# EasyEDA schematic MainBoard_2020-05-08_18-35-21.json
TITLE: Main Board; REV: 1.0; Date: 2019-05-19; Sheet: 1/1; Drawn By: jimbotops; Company: TophamTech
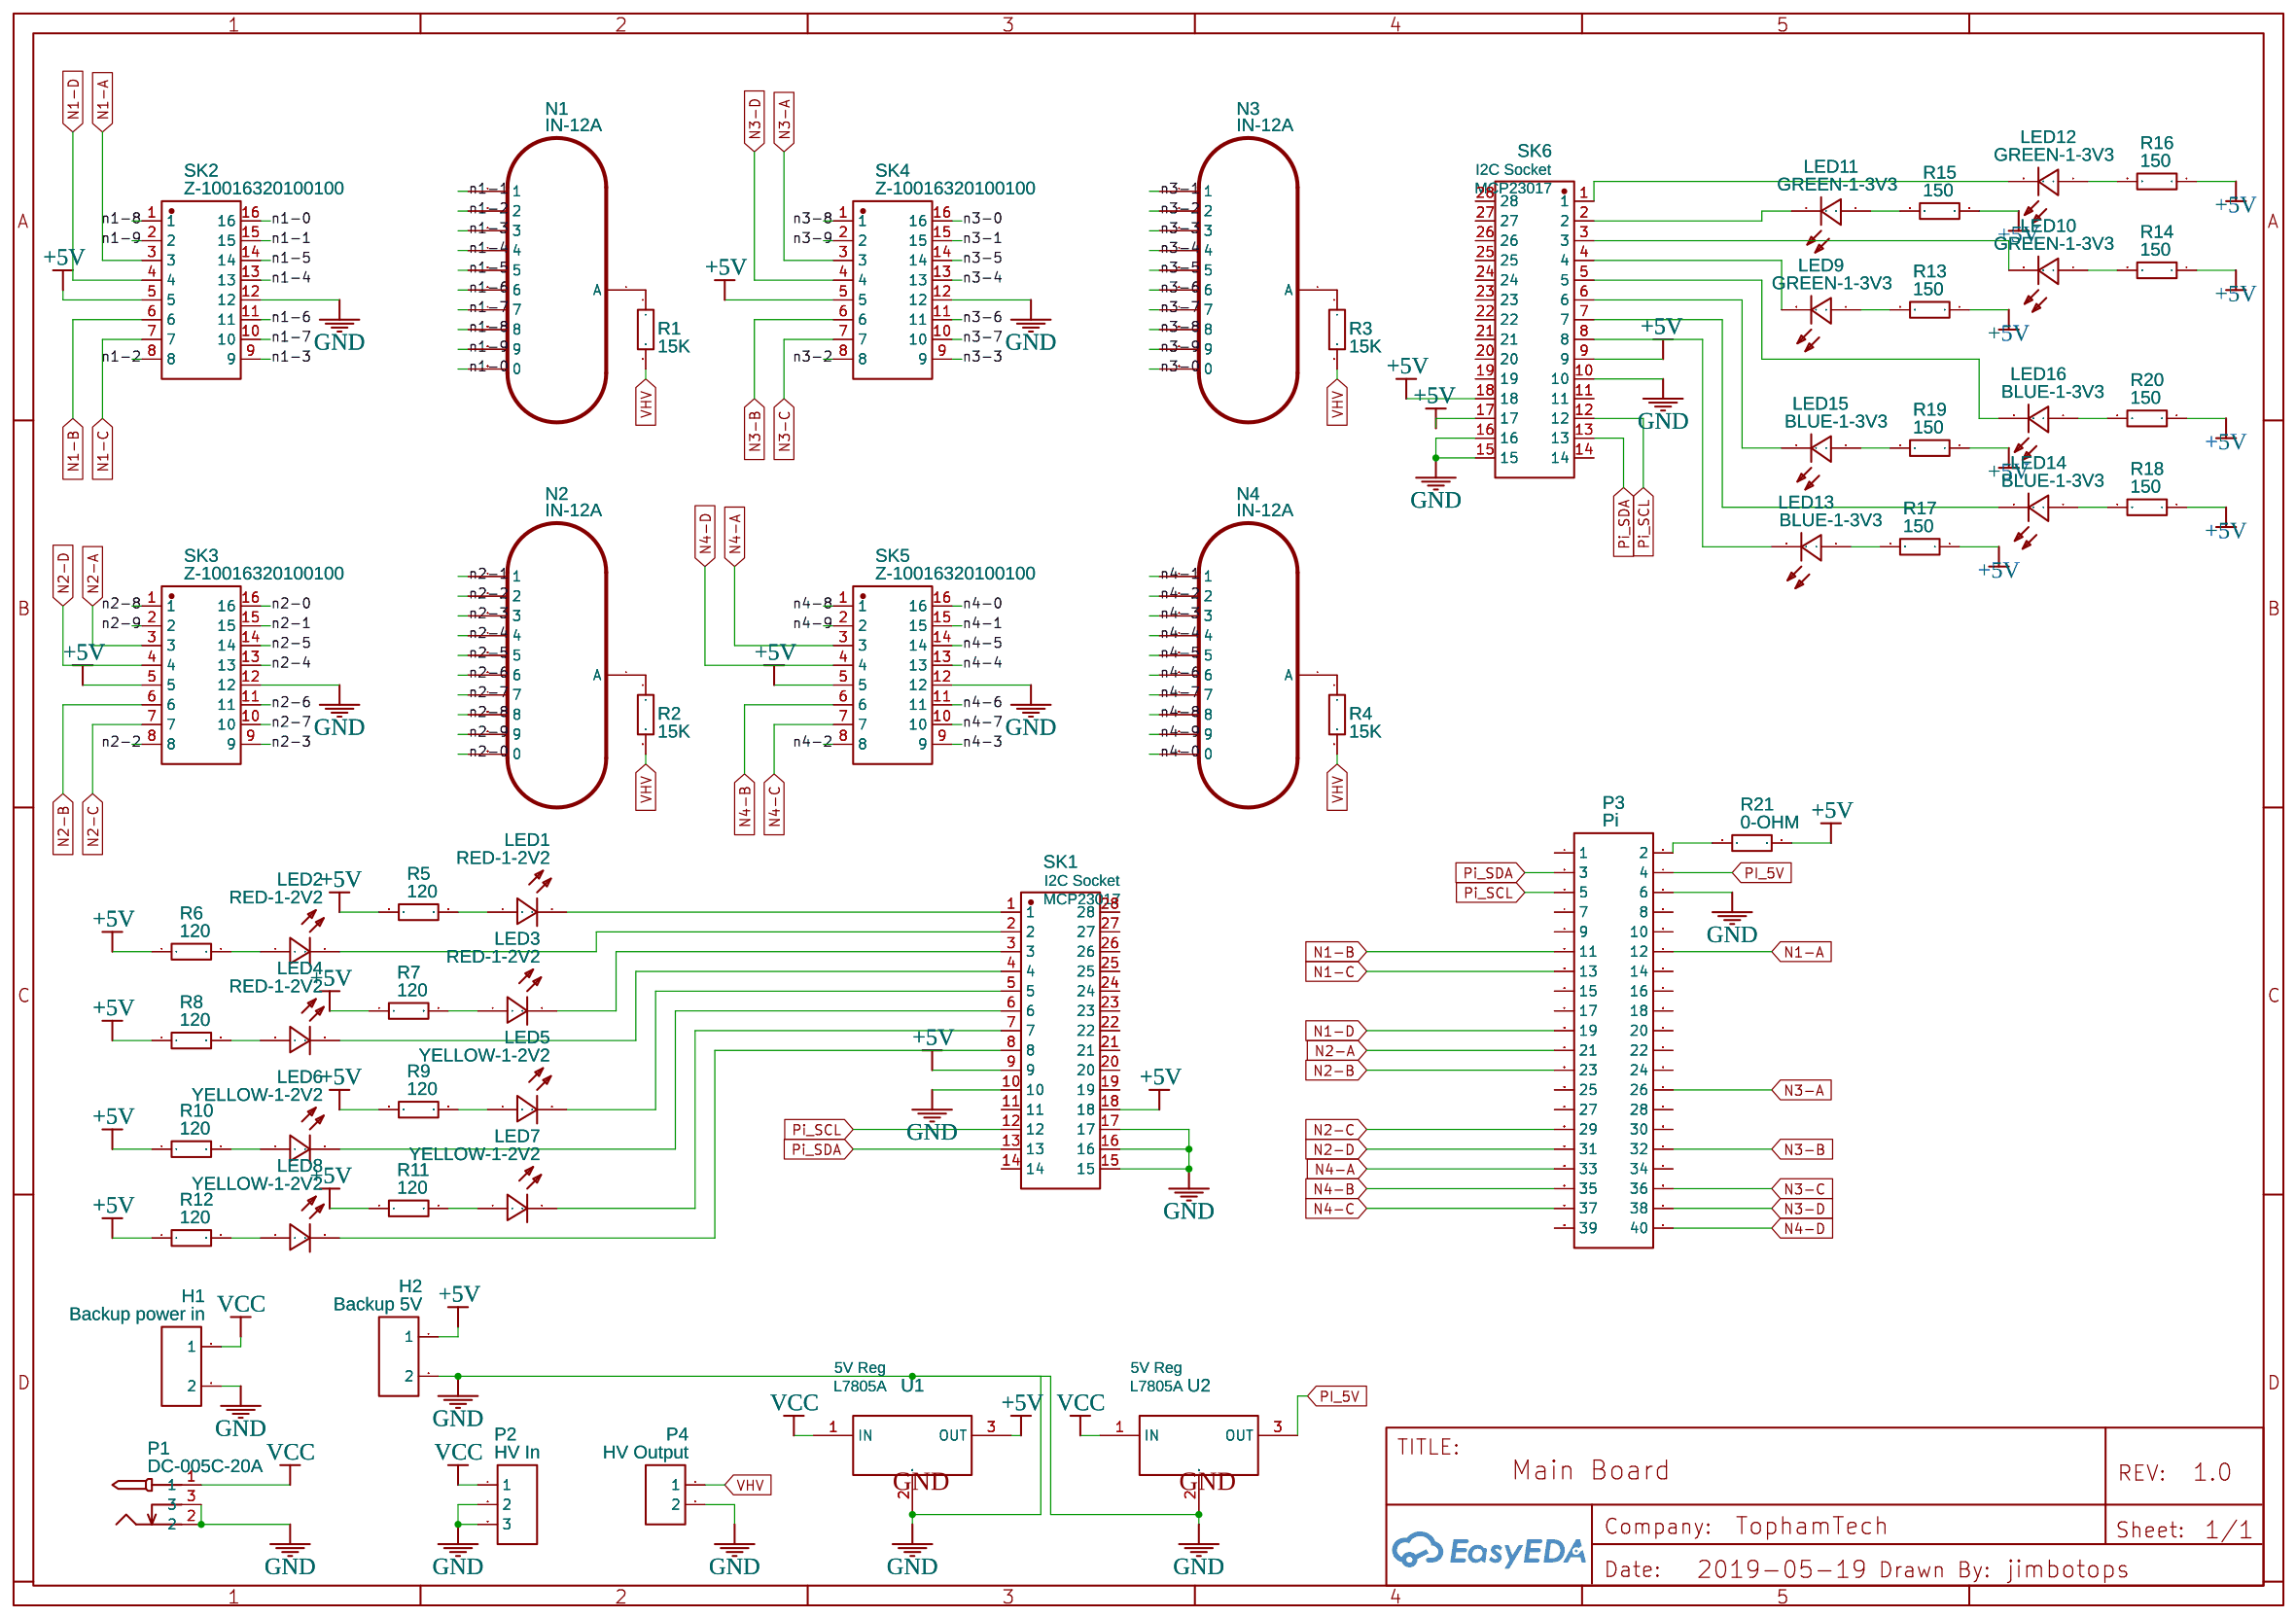
[diagram p0: schematic sheet]

## Parts
H1  Backup power in  [HDR-2X1/2.54]
H2  Backup 5V  [HDR-2X1/2.54]
LED1  RED-1-2V2  [LED-1206]
LED2  RED-1-2V2  [LED-1206]
LED3  RED-1-2V2  [LED-1206]
LED4  RED-1-2V2  [LED-1206]
LED5  YELLOW-1-2V2  [LED-1206]
LED6  YELLOW-1-2V2  [LED-1206]
LED7  YELLOW-1-2V2  [LED-1206]
LED8  YELLOW-1-2V2  [LED-1206]
LED9  GREEN-1-3V3  [LED-1206]
LED10  GREEN-1-3V3  [LED-1206]
LED11  GREEN-1-3V3  [LED-1206]
LED12  GREEN-1-3V3  [LED-1206]
LED13  BLUE-1-3V3  [LED-1206]
LED14  BLUE-1-3V3  [LED-1206]
LED15  BLUE-1-3V3  [LED-1206]
LED16  BLUE-1-3V3  [LED-1206]
N1  IN-12A  [IN-12]
N2  IN-12A  [IN-12]
N3  IN-12A  [IN-12]
N4  IN-12A  [IN-12]
P1  DC-005C-20A  [DC-005C-A]
P2  HV In  [HDR-3X1/2.54]
P3  Pi  [HDR-TH_40PIN-V-ROW2-COL20-FEMALE-PITCH2.54]
P4  HV Output  [HDR-1X2/2.54]
R1  15K  [2010]
R2  15K  [2010]
R3  15K  [2010]
R4  15K  [2010]
R5  120  [1206]
R6  120  [1206]
R7  120  [1206]
R8  120  [1206]
R9  120  [1206]
R10  120  [1206]
R11  120  [1206]
R12  120  [1206]
R13  150  [1206]
R14  150  [1206]
R15  150  [1206]
R16  150  [1206]
R17  150  [1206]
R18  150  [1206]
R19  150  [1206]
R20  150  [1206]
R21  0-OHM  [1206]
SK1  I2C Socket\nMCP23017  [DIP-283]
SK2  Z-10016320100100  [DIP-16]
SK3  Z-10016320100100  [DIP-16]
SK4  Z-10016320100100  [DIP-16]
SK5  Z-10016320100100  [DIP-16]
SK6  I2C Socket\nMCP23017  [DIP-283]
U1  5V Reg\nL7805A  [D2PAK]
U2  5V Reg\nL7805A  [D2PAK]

## Library data of the parts
H1 H2 = -: Supplier: LCSC; Manufacturer: TE Connectivity; Manufacturer Part: 826629-2; image: //image.lceda.cn/szlcsc/C86471.jpg; Supplier Part: C86471
LED1-LED16 = -: Supplier: LCSC; Supplier Part: C264329; Manufacturer: Everlight Elec; Manufacturer Part: 11-21/GPC-AM2P1/2T; Contributor: LCSC
N1-N4 = -: Manufacturer Part: ?
P1 = -: Supplier: LCSC; Manufacturer: HRO; Supplier Part: C84007
P2 = -: Supplier Part: C146243; Supplier: LCSC; Manufacturer: Boom Precision Elec; Manufacturer Part: Header-Female-2.54_1x3; link: https://datasheet.lcsc.com/szlcsc/Boom-Precision-Elec-2-54mm-1-8P-Straight-Female-header_C27438.pdf
P3 = -: Supplier: LCSC; Manufacturer: BOOMELE; Manufacturer Part: 2.54mm 2*20PFemale header; image: //image.lceda.cn/szlcsc/C50982.jpg; Supplier Part: C50982
P4 = -: Supplier: LCSC; Manufacturer: BOOMELE; Manufacturer Part: 2.54-1*2PFemale; image: //image.lceda.cn/szlcsc/C49661.jpg; Supplier Part: C49661
R1-R4 = 2010W2J0153T4S: Supplier: LCSC; Manufacturer: UniOhm; Supplier Part: C20362
R5-R20 = 1206W4F1200T5E: Supplier: LCSC; Manufacturer: UniOhm; Supplier Part: C14661
R21 = 1206W4F3650T5E: Supplier: LCSC; Manufacturer: UniOhm; Contributor: LCSC; Supplier Part: C172882; LCSC Assembly: Yes; SMT Type: Extend
SK1 SK6 = -: Supplier: LCSC; Supplier Part: C146582; Manufacturer: Shenzhen Cankemeng; Contributor: LCSC
SK2-SK5 = -: Supplier: LCSC; Supplier Part: C157594; Manufacturer: Nextronics Engineering; Contributor: LCSC
U1 U2 = -: Supplier: LCSC; Manufacturer: STMicroelectronics; Manufacturer Part: L7805ABD2T-TR; Supplier Part: C86206; LCSC Assembly: Yes; SMT Type: Extend

## Nets
+5V: H2.1 R5.1 R6.1 R7.1 R8.1 R9.1 R10.1 R11.1 R12.1 R13.1 R14.1 R15.1 R16.1 R17.1 R18.1 R19.1 R20.1 R21.2 SK1.9 SK1.18 SK2.5 SK3.5 SK4.5 SK5.5 SK6.9 SK6.17 SK6.18 U1.3(OUT)
GND: H1.2 H2.2 P1.2 P1.3 P2.2 P2.3 P3.6 P4.2 SK1.10 SK1.15 SK1.16 SK1.17 SK2.12 SK3.12 SK4.12 SK5.12 SK6.10 SK6.15 SK6.16 U1.2(GND) U2.2(GND)
VCC: H1.1 P1.1 P2.1 U1.1(IN) U2.1(IN)
n1-0: N1.0 SK2.16
n1-1: N1.1 SK2.15
n1-2: N1.2 SK2.8
n1-3: N1.3 SK2.9
n1-4: N1.4 SK2.13
n1-5: N1.5 SK2.14
n1-6: N1.6 SK2.11
n1-7: N1.7 SK2.10
n1-8: N1.8 SK2.1
n1-9: N1.9 SK2.2
N1-A: P3.12 SK2.3
N1-B: P3.11 SK2.6
N1-C: P3.13 SK2.7
N1-D: P3.19 SK2.4
n2-0: N2.0 SK3.16
n2-1: N2.1 SK3.15
n2-2: N2.2 SK3.8
n2-3: N2.3 SK3.9
n2-4: N2.4 SK3.13
n2-5: N2.5 SK3.14
n2-6: N2.6 SK3.11
n2-7: N2.7 SK3.10
n2-8: N2.8 SK3.1
n2-9: N2.9 SK3.2
N2-A: P3.21 SK3.3
N2-B: P3.23 SK3.6
N2-C: P3.29 SK3.7
N2-D: P3.31 SK3.4
n3-0: N3.0 SK4.16
n3-1: N3.1 SK4.15
n3-2: N3.2 SK4.8
n3-3: N3.3 SK4.9
n3-4: N3.4 SK4.13
n3-5: N3.5 SK4.14
n3-6: N3.6 SK4.11
n3-7: N3.7 SK4.10
n3-8: N3.8 SK4.1
n3-9: N3.9 SK4.2
N3-A: P3.26 SK4.3
N3-B: P3.32 SK4.6
N3-C: P3.36 SK4.7
N3-D: P3.38 SK4.4
n4-0: N4.0 SK5.16
n4-1: N4.1 SK5.15
n4-2: N4.2 SK5.8
n4-3: N4.3 SK5.9
n4-4: N4.4 SK5.13
n4-5: N4.5 SK5.14
n4-6: N4.6 SK5.11
n4-7: N4.7 SK5.10
n4-8: N4.8 SK5.1
n4-9: N4.9 SK5.2
N4-A: P3.33 SK5.3
N4-B: P3.35 SK5.6
N4-C: P3.37 SK5.7
N4-D: P3.40 SK5.4
PI_5V: P3.4 U2.3(OUT)
Pi_SCL: P3.5 SK1.12 SK6.12
Pi_SDA: P3.3 SK1.13 SK6.13
VHV: P4.1 R1.2 R2.2 R3.2 R4.2
Net-(LED1-1): LED1.1(A) R5.2
Net-(LED1-2): LED1.2(K) SK1.1
Net-(LED2-1): LED2.1(A) R6.2
Net-(LED2-2): LED2.2(K) SK1.2
Net-(LED3-1): LED3.1(A) R7.2
Net-(LED3-2): LED3.2(K) SK1.3
Net-(LED4-1): LED4.1(A) R8.2
Net-(LED4-2): LED4.2(K) SK1.4
Net-(LED5-1): LED5.1(A) R9.2
Net-(LED5-2): LED5.2(K) SK1.5
Net-(LED6-1): LED6.1(A) R10.2
Net-(LED6-2): LED6.2(K) SK1.6
Net-(LED7-1): LED7.1(A) R11.2
Net-(LED7-2): LED7.2(K) SK1.7
Net-(LED8-1): LED8.1(A) R12.2
Net-(LED8-2): LED8.2(K) SK1.8
Net-(LED9-1): LED9.1(A) R13.2
Net-(LED9-2): LED9.2(K) SK6.4
Net-(LED10-1): LED10.1(A) R14.2
Net-(LED10-2): LED10.2(K) SK6.3
Net-(LED11-1): LED11.1(A) R15.2
Net-(LED11-2): LED11.2(K) SK6.2
Net-(LED12-1): LED12.1(A) R16.2
Net-(LED12-2): LED12.2(K) SK6.1
Net-(LED13-1): LED13.1(A) R17.2
Net-(LED13-2): LED13.2(K) SK6.8
Net-(LED14-1): LED14.1(A) R18.2
Net-(LED14-2): LED14.2(K) SK6.7
Net-(LED15-1): LED15.1(A) R19.2
Net-(LED15-2): LED15.2(K) SK6.6
Net-(LED16-1): LED16.1(A) R20.2
Net-(LED16-2): LED16.2(K) SK6.5
Net-(N1-A): N1.A R1.1
Net-(N2-A): N2.A R2.1
Net-(N3-A): N3.A R3.1
Net-(N4-A): N4.A R4.1
Net-(P3-2): P3.2 R21.1

Not connected (* = marked no-connect by the designer): P3 1 7 8 9 10 14 15 16 17 18 20 22 24 25 27 28 30 34 39; SK1 11 14 19 20 21 22 23 24 25 26 27 28; SK6 11 14 19 20 21 22 23 24 25 26 27 28
